# Altium schematic sheet EPS_PCB.SchDoc
size 297 x 209 mm
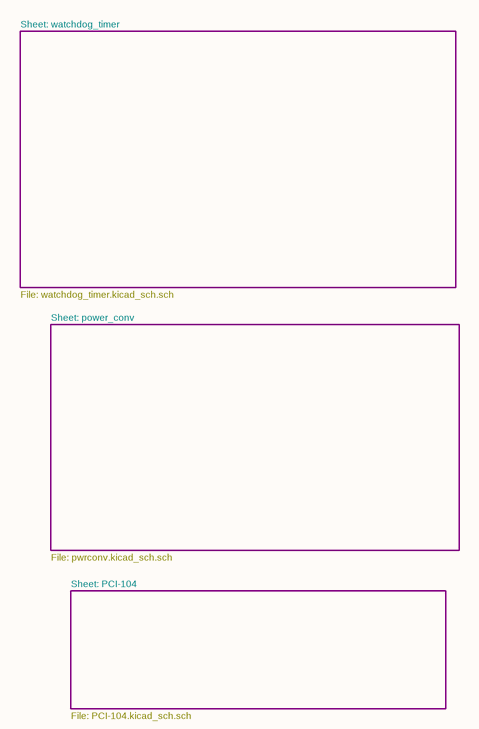
[diagram p0: EPS_PCB.SchDoc]

## Sub-sheets
PCI-104 = PCI-104.SchDoc: no entries
power_conv = pwrconv.SchDoc: no entries
watchdog_timer = watchdog_timer.SchDoc: no entries

## Notes on the sheet
- Sheet: watchdog_timer
- File: watchdog_timer.kicad_sch.sch
- Sheet: power_conv
- File: pwrconv.kicad_sch.sch
- Sheet: PCI-104
- File: PCI-104.kicad_sch.sch
- 1
- 2
- 3
- 4
- 5
- 6
- A
- B
- C
- D
- Title:
- File: EPS_PCB.kicad_sch
- Sheet: /
- KiCad E.D.A.  kicad (5.1.4)-1
- Size: A4
- Date: 2025-11-13
- Rev:
- Id: 1/1